# Altium schematic sheet MFX.SchDoc: MFX
size A4; DocumentNumber: MB1165; Revision: C.1; SheetNumber: 16; SheetTotal: 17; Project: STM32469I-EVAL
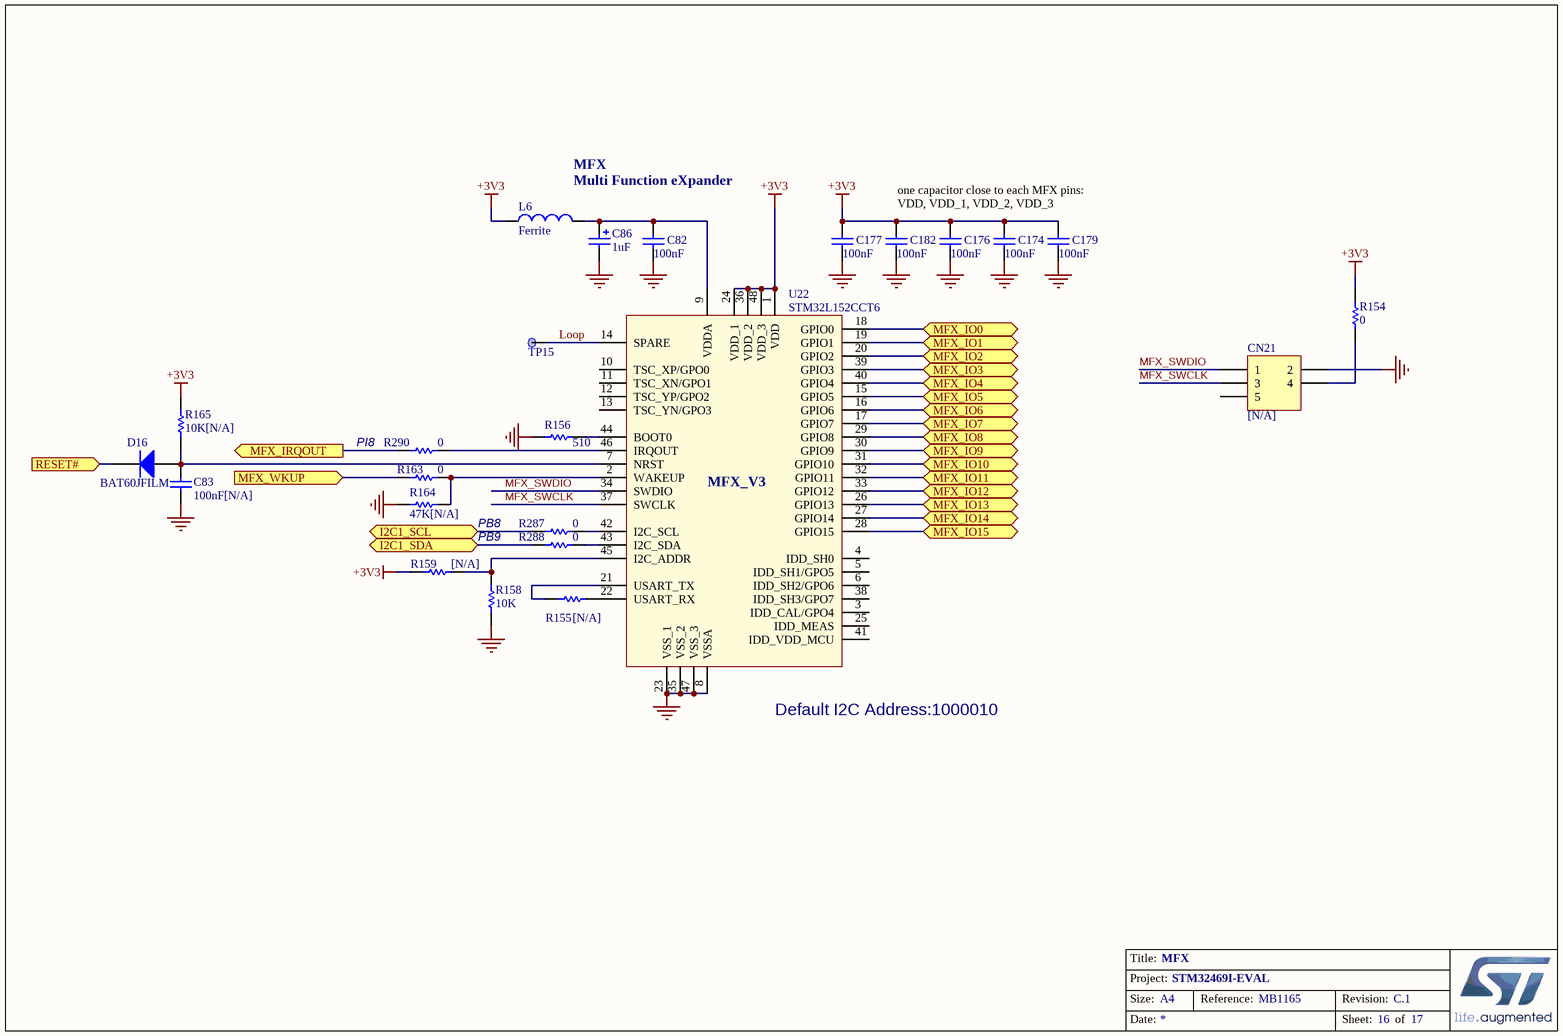
[diagram p0: MFX.SchDoc]

## Parts
C82  100nF  [0402C]
C83  100nF[N/A]  [0402C]
C86  1uF  [TAN-A]
C174  100nF  [0402C]
C176  100nF  [0402C]
C177  100nF  [0402C]
C179  100nF  [0402C]
C182  100nF  [0402C]
CN21  [N/A]  [HDR_2X3-1_2R54-6]
D16  BAT60JFILM  [SOD-323]
L6  Ferrite  [0603L]
R154  0  [0603R]
R155  [N/A]  [0603R]
R156  510  [0402R]
R158  10K  [0402R]
R159  [N/A]  [0603R]
R163  0  [0603R]
R164  47K[N/A]  [0402R]
R165  10K[N/A]  [0402R]
R287  0  [0603R]
R288  0  [0603R]
R290  0  [0603R]
TP15  (no value)  [TP]
U22  STM32L152CCT6  [LQFP48_0R5_9X9]

## Ports
I2C1_SCL (bidir), I2C1_SDA (bidir), MFX_IO0 (bidir), MFX_IO1 (bidir), MFX_IO2 (bidir), MFX_IO3 (bidir), MFX_IO4 (bidir), MFX_IO5 (bidir), MFX_IO6 (bidir), MFX_IO7 (bidir), MFX_IO8 (bidir), MFX_IO9 (bidir), MFX_IO10 (bidir), MFX_IO11 (bidir), MFX_IO12 (bidir), MFX_IO13 (bidir), MFX_IO14 (bidir), MFX_IO15 (bidir), MFX_IRQOUT (out), MFX_WKUP (in), RESET# (in)

## Nets
+3V3: C174.2 C176.1 C177.2 C179.2 C182.2 L6.1 R154.1 R159.2 R165.2 U22.1(VDD) U22.24(VDD_1) U22.36(VDD_2) U22.48(VDD_3)
GND: C82.1 C83.1 C86.2 C174.1 C176.2 C177.1 C179.1 C182.1 CN21.2 R156.2 R158.2 R164.1 U22.8(VSSA) U22.23(VSS_1) U22.35(VSS_2) U22.47(VSS_3)
I2C1_SCL: R287.1 ; port I2C1_SCL
I2C1_SDA: R288.1 ; port I2C1_SDA
Loop: TP15.1 U22.14(SPARE)
MFX_IO0: U22.18(GPIO0) ; port MFX_IO0
MFX_IO1: U22.19(GPIO1) ; port MFX_IO1
MFX_IO2: U22.20(GPIO2) ; port MFX_IO2
MFX_IO3: U22.39(GPIO3) ; port MFX_IO3
MFX_IO4: U22.40(GPIO4) ; port MFX_IO4
MFX_IO5: U22.15(GPIO5) ; port MFX_IO5
MFX_IO6: U22.16(GPIO6) ; port MFX_IO6
MFX_IO7: U22.17(GPIO7) ; port MFX_IO7
MFX_IO8: U22.29(GPIO8) ; port MFX_IO8
MFX_IO9: U22.30(GPIO9) ; port MFX_IO9
MFX_IO10: U22.31(GPIO10) ; port MFX_IO10
MFX_IO11: U22.32(GPIO11) ; port MFX_IO11
MFX_IO12: U22.33(GPIO12) ; port MFX_IO12
MFX_IO13: U22.26(GPIO13) ; port MFX_IO13
MFX_IO14: U22.27(GPIO14) ; port MFX_IO14
MFX_IO15: U22.28(GPIO15) ; port MFX_IO15
MFX_IRQOUT: R290.1 ; port MFX_IRQOUT
MFX_SWCLK: CN21.3 U22.37(SWCLK)
MFX_SWDIO: CN21.1 U22.34(SWDIO)
MFX_WKUP: R163.2 ; port MFX_WKUP
RESET#: D16.2(K) ; port RESET#
NetC82_2: C82.2 C86.1 L6.2 U22.9(VDDA)
NetC83_2: C83.2 D16.1(A) R165.1 U22.7(NRST)
NetCN21_4: CN21.4 R154.2
NetR155_1: R155.1 U22.21(USART_TX)
NetR155_2: R155.2 U22.22(USART_RX)
NetR156_1: R156.1 U22.44(BOOT0)
NetR158_1: R158.1 R159.1 U22.45(I2C_ADDR)
NetR163_1: R163.1 R164.2 U22.2(WAKEUP)
NetR287_2: R287.2 U22.42(I2C_SCL)
NetR288_2: R288.2 U22.43(I2C_SDA)
NetR290_2: R290.2 U22.46(IRQOUT)

Not connected (* = marked no-connect by the designer): CN21 5; U22 3(IDD_CAL/GPO4) 4(IDD_SH0) 5(IDD_SH1/GPO5) 6(IDD_SH2/GPO6) 10(TSC_XP/GPO0) 11(TSC_XN/GPO1) 12(TSC_YP/GPO2) 13(TSC_YN/GPO3) 25(IDD_MEAS) 38(IDD_SH3/GPO7) 41(IDD_VDD_MCU)

## Notes on the sheet
- MFX
  Multi Function eXpander
- one capacitor close to each MFX pins: VDD, VDD_1, VDD_2, VDD_3
- PI8
- PB8
- PB9
- (near U22) Default I2C Address:1000010
- Title:
- Project:
- Size:
- Date:
- A4
- Reference:
- Sheet:
- Revision:
- of
- (in symbol MFX) MFX_V3

## Library data of the parts
C82 C83 C174 C176 C177 C179 C182 = Cap_100nF_X7R_10%_0402: Capacitor,100nF,16V,X7R,10%,0402,YAGEO; Manuf_Part_1: CC0402KRX7R7BB104; Revision: July-2002: Re-released for DXP Platform.; Value: 100nF; Order: CC0402KRX7R7BB104; Manuf_1: YAGEO
C86 = Cap_1uF_POL_10%_TANA: Polarized Capacitor,1uF,16V,10%,typeA,AVX; Manuf_Part_1: TAJA105K016R; Revision: July-2002: Re-released for DXP Platform.; Value: 1uF; Order: TAJA105K016R; Manuf_1: AVX; Distrib: *
CN21 = Header 3X2: Header, 3-Pin, Dual row; Revision: 17-Jul-2002: Re-released for DXP Platform.; Publisher: Altium Limited
D16 = Diode: Default Diode; Code - JEDEC: DO-214-AB; Published: 8-Jun-2000; Revision: July-2002: Re-released for DXP Platform.; Publisher: Altium Limited
L6 = BEAD_600R_350MA_0603: Bead,600R,350mA,0603,FCM1608KF-601T03,Tai-tech; Manuf_2: TDK; Manuf_Part_2: MPZ1608S300A; Value: 100uH; Comment_1: bead,30R,5A,0603,MPZ1608S300A,TDK; Revision: July-2002: Re-released for DXP Platform.; Manuf_Part_1: FCM1608KF-601T03; Order: FCM1608KF-601T03; Manuf_1: Tai-tech
R154 R287 R288 R290 = Res1: Resistor; Value: 1K; Ordered by: Subcon; Published: 8-Jun-2000; Revision: July-2002: Re-released for DXP Platform.; Publisher: Altium Limited
R155 = res1: Resistor; Value: 1K; Ordered by: Subcon; Published: 8-Jun-2000; Revision: July-2002: Re-released for DXP Platform.; Publisher: Altium Limited
R156 R164 R165 = Resistor_ST: Resistor 0402 / 0603 / 0805; Description: Resistor 0402 or 0603 or 0805; Value: 10K
R158 = Resistor_ST: Resistor 0402 / 0603 / 0805; Description: Resistor 0402 or 0603 or 0805; Value: 10K
R159 R163 = Res1: Resistor; Value: 1K; Published: 8-Jun-2000; Revision: July-2002: Re-released for DXP Platform.; Publisher: Altium Limited
TP15 = TP
U22 = MFX: Multifunction expander